# EAGLE design ACC (EAGLE 9.6.2)
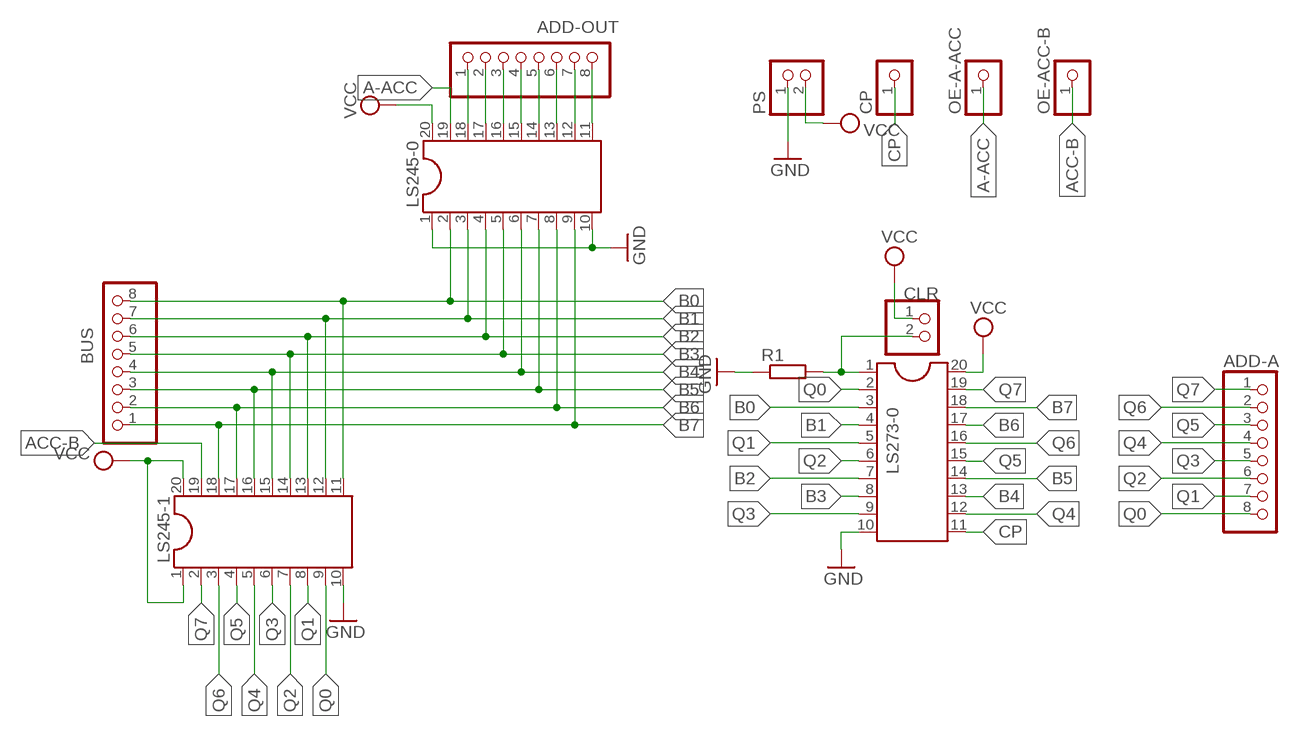
[diagram p0: schematic, sheet 1]

## Parts
ADD-A  PINHD-1X8  [1X08]
ADD-OUT  PINHD-1X8  [1X08]
BUS  PINHD-1X8  [1X08]
CLR  PINHD-1X2  [1X02]
CP  PINHD-1X1  [1X01]
LS245-0  DIL20S  [SOCKET-20]
LS245-1  DIL20S  [SOCKET-20]
LS273-0  DIL20S  [SOCKET-20]
OE-A-ACC  PINHD-1X1  [1X01]
OE-ACC-B  PINHD-1X1  [1X01]
PS  PINHD-1X2  [1X02]
R1  R-EU_0204/7  [0204/7]

## Nets
A-ACC: LS245-0.19 OE-A-ACC.1
ACC-B: LS245-1.19 OE-ACC-B.1
B0: BUS.8 LS245-0.2 LS245-1.11 LS273-0.3
B1: BUS.7 LS245-0.3 LS245-1.12 LS273-0.4
B2: BUS.6 LS245-0.4 LS245-1.13 LS273-0.7
B3: BUS.5 LS245-0.5 LS245-1.14 LS273-0.8
B4: BUS.4 LS245-0.6 LS245-1.15 LS273-0.13
B5: BUS.3 LS245-0.7 LS245-1.16 LS273-0.14
B6: BUS.2 LS245-0.8 LS245-1.17 LS273-0.17
B7: BUS.1 LS245-0.9 LS245-1.18 LS273-0.18
CLR: CLR.2 LS273-0.1 R1.2
CP: CP.1 LS273-0.11
GND: LS245-0.1 LS245-0.10 LS245-1.10 LS273-0.10 PS.1 R1.1
O0: ADD-OUT.1 LS245-0.18
O1: ADD-OUT.2 LS245-0.17
O2: ADD-OUT.3 LS245-0.16
O3: ADD-OUT.4 LS245-0.15
O4: ADD-OUT.5 LS245-0.14
O5: ADD-OUT.6 LS245-0.13
O6: ADD-OUT.7 LS245-0.12
O7: ADD-OUT.8 LS245-0.11
Q0: ADD-A.8 LS245-1.9 LS273-0.2
Q1: ADD-A.7 LS245-1.8 LS273-0.5
Q2: ADD-A.6 LS245-1.7 LS273-0.6
Q3: ADD-A.5 LS245-1.6 LS273-0.9
Q4: ADD-A.4 LS245-1.5 LS273-0.12
Q5: ADD-A.3 LS245-1.4 LS273-0.15
Q6: ADD-A.2 LS245-1.3 LS273-0.16
Q7: ADD-A.1 LS245-1.2 LS273-0.19
VCC: CLR.1 LS245-0.20 LS245-1.1 LS245-1.20 LS273-0.20 PS.2

## Library data of the parts
ADD-A ADD-OUT BUS = pinhead:PINHD-1X8: PIN HEADER
CLR PS = pinhead:PINHD-1X2: PIN HEADER
CP OE-A-ACC OE-ACC-B = pinhead:PINHD-1X1: PIN HEADER
LS245-0 LS245-1 LS273-0 = ic-package:DIL20: Dual In Line / Socket
R1 = rcl:R-EU_: RESISTOR, European symbol; SPICEPREFIX: R

## Board
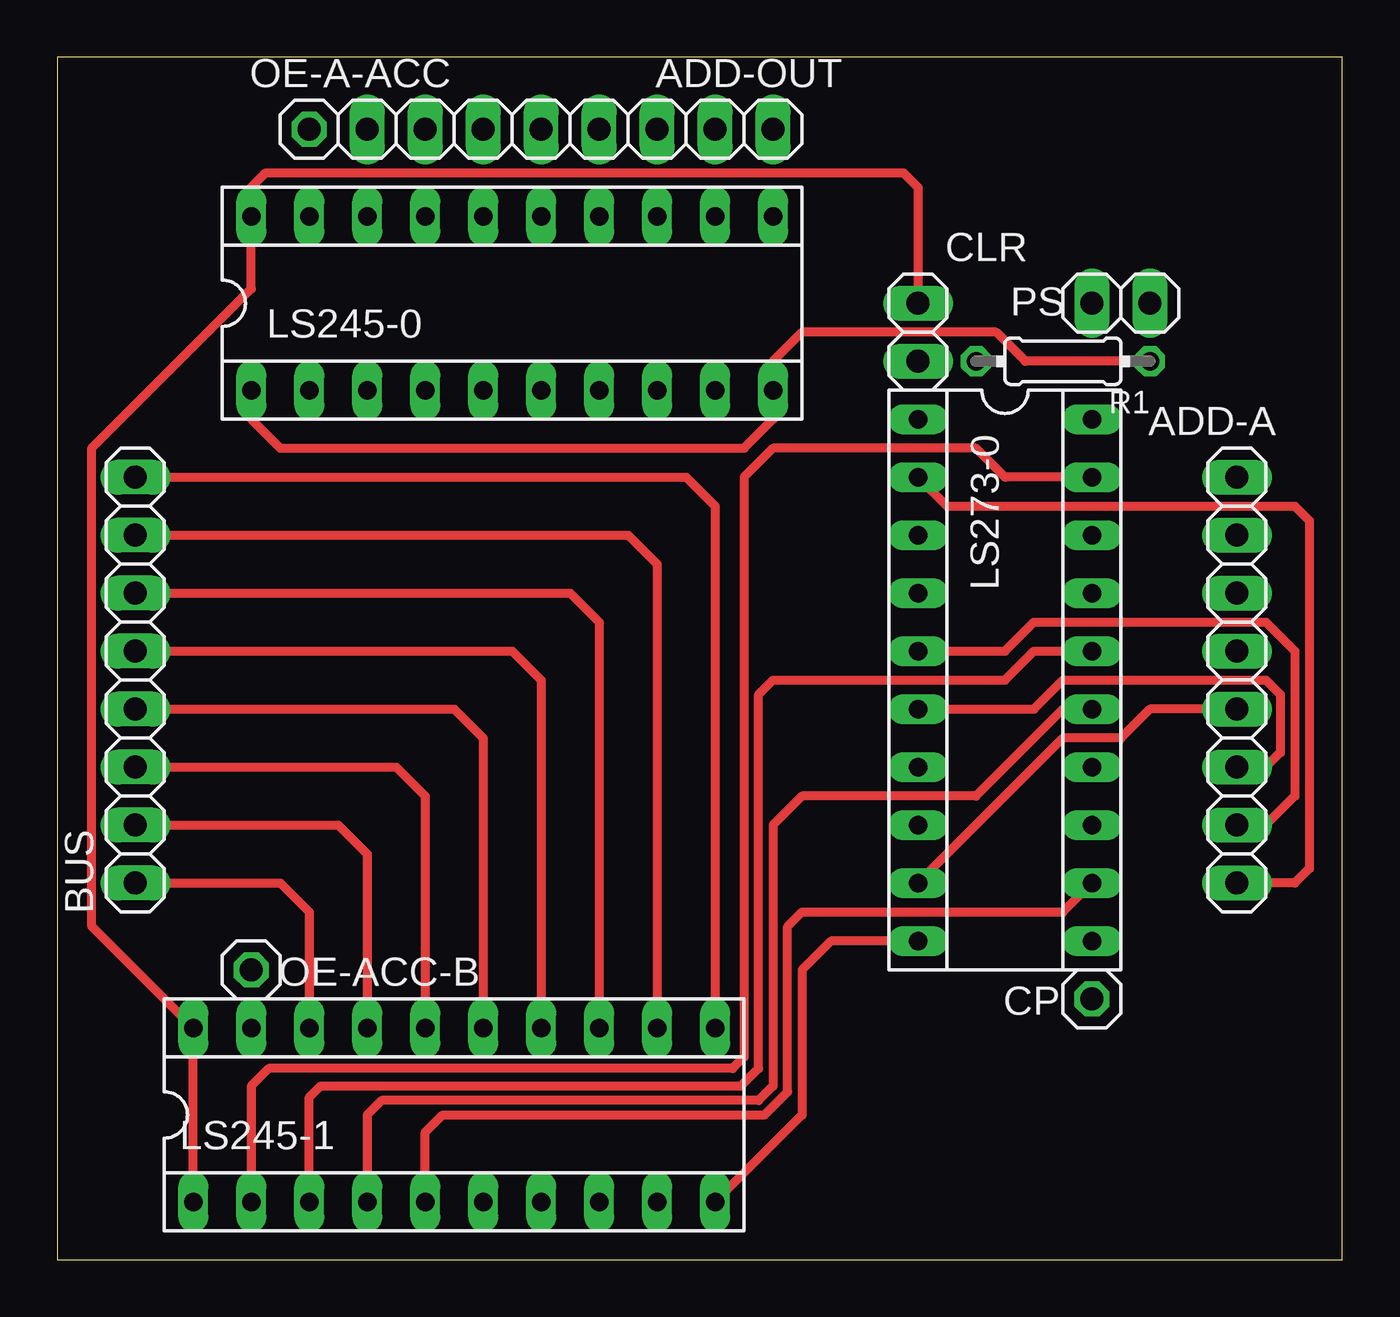
[diagram p1: board, top side]
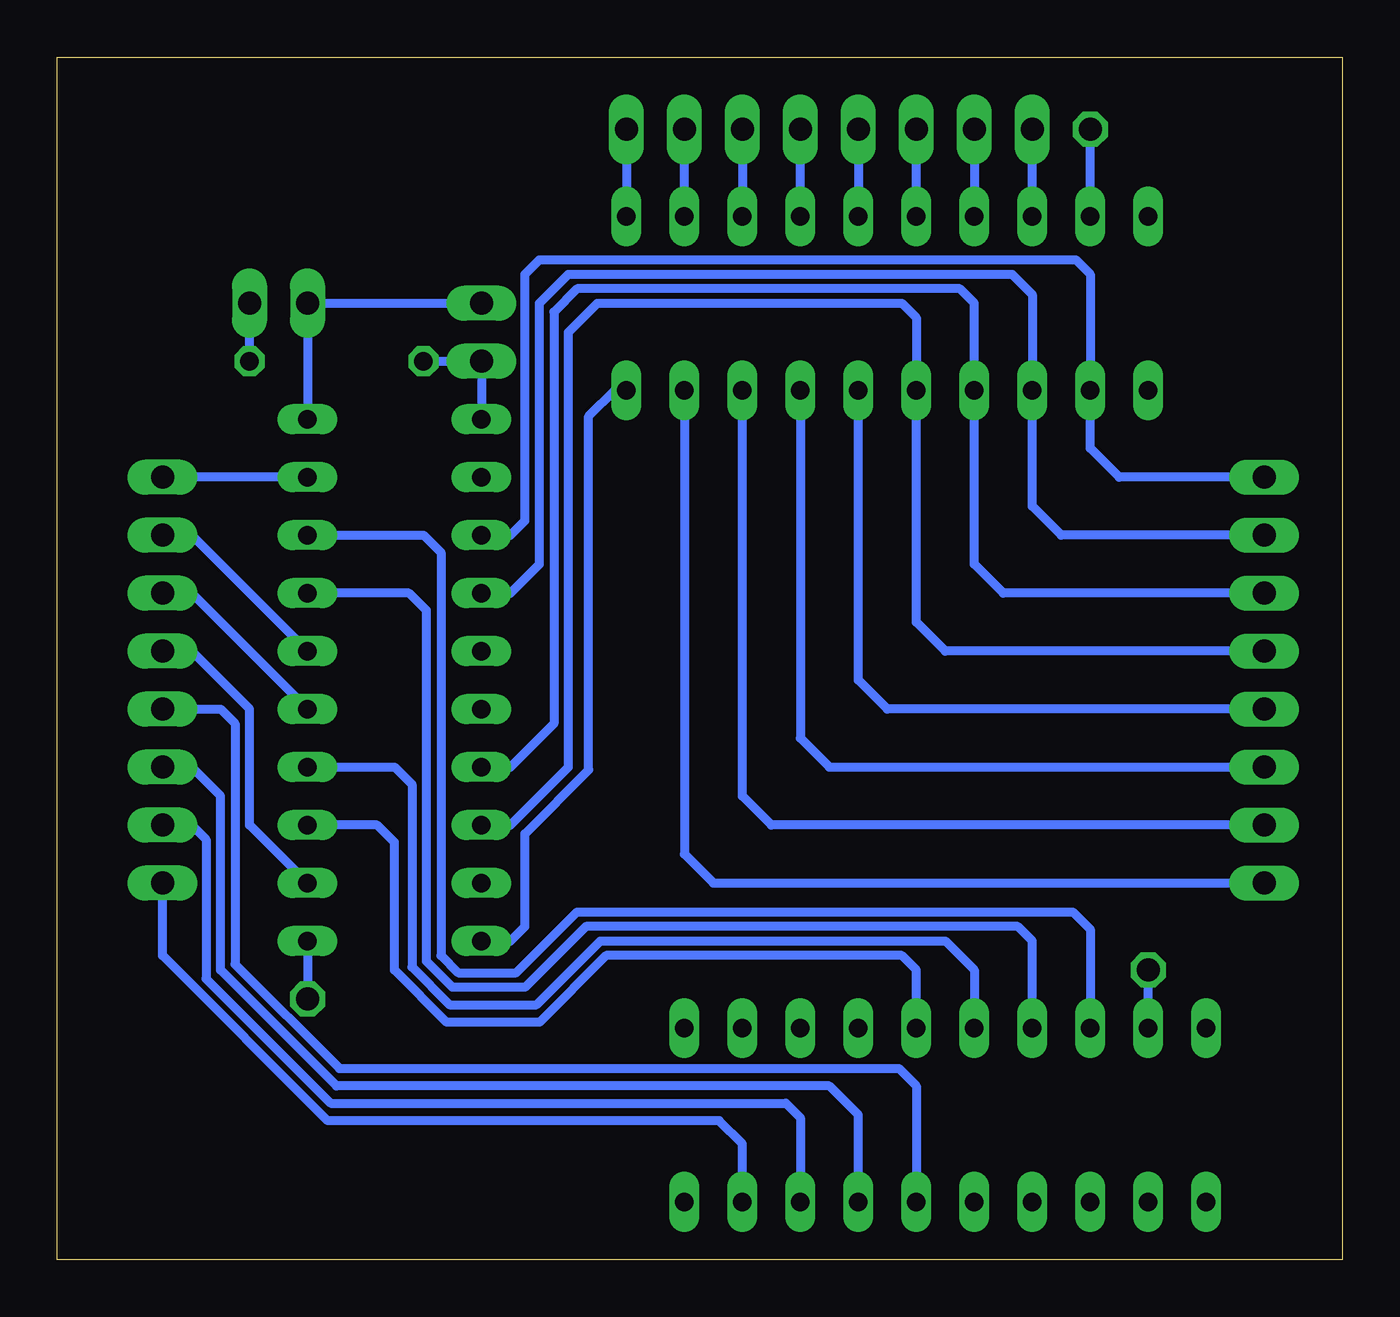
[diagram p2: board, bottom side, seen from below]

Size 56.31 x 52.7 mm. Coordinates in mm from the lower left corner, seen from the top.
Outline: 0,0 56.31,0 56.31,52.7 0,52.7 0,0
Copper layers (1*16): Top 0.035mm / dielectric 1.5mm / Bottom 0.035mm
Design rules "default": minimum track width 6mil, minimum drill 0.35mm, track to track 6mil, track to pad 6mil, pad to pad 6mil, via to via 6mil, smd to smd 6mil, copper to edge 40mil, drill to drill 6mil, minimum pad ring 10mil, minimum via ring 8mil, stop-mask expansion 4mil, vias tented up to drill 0mil, thermal gap 10mil

### Footprints (pad centres in the part's own frame; a part is rotated, then mirrored left to right if it is on the bottom)
1X08 = drill 1.016 long: 1 -8.89,0; 2 -6.35,0; 3 -3.81,0; 4 -1.27,0; 5 1.27,0; 6 3.81,0; 7 6.35,0; 8 8.89,0
1X02 = drill 1.016 long: 1 -1.27,0; 2 1.27,0
1X01 = drill 1.016 octagon: 1 0,0
SOCKET-20 = drill 0.813 long: 1 -11.43,-3.81; 2 -8.89,-3.81; 3 -6.35,-3.81; 4 -3.81,-3.81; 5 -1.27,-3.81; 6 1.27,-3.81; 7 3.81,-3.81; 8 6.35,-3.81; 9 8.89,-3.81; 10 11.43,-3.81; 11 11.43,3.81; 12 8.89,3.81; 13 6.35,3.81; 14 3.81,3.81; 15 1.27,3.81; 16 -1.27,3.81; 17 -3.81,3.81; 18 -6.35,3.81; 19 -8.89,3.81; 20 -11.43,3.81
0204/7 = drill 0.813 octagon: 1 -3.81,0; 2 3.81,0

### Placement (x,y rotation side)
ADD-A  51.69,25.4 270 top
ADD-OUT  22.48,49.53 0 top
BUS  3.43,25.4 90 top
CLR  37.72,40.64 270 top
CP  45.34,11.43 0 top
LS245-0  19.94,41.91 0 top
LS245-1  17.4,6.35 0 top
LS273-0  41.53,25.4 270 top
OE-A-ACC  11.05,49.53 0 top
OE-ACC-B  8.51,12.7 0 top
PS  46.61,41.91 180 top
R1  44.07,39.37 180 top

### Tracks (layer width: path | path; a pad name or v marks a point on that pad's centre or on a via)
A-ACC
  Bottom 0.4: LS245-0.19 OE-A-ACC.1
ACC-B
  Bottom 0.4: LS245-1.19 OE-ACC-B.1
B0
  Top 0.4: LS245-1.11 28.83,33.02 27.56,34.29 BUS.8
  Bottom 0.4: BUS.8 9.78,34.29 11.05,35.56 LS245-0.2 11.05,43.18 11.68,43.81 35.18,43.81 35.81,43.18 35.81,32.38 36.45,31.75 LS273-0.3
B1
  Top 0.4: LS245-1.12 26.29,30.48 25.02,31.75 BUS.7
  Bottom 0.4: BUS.7 12.32,31.75 13.59,33.02 LS245-0.3 13.59,42.29 14.48,43.18 33.91,43.18 35.18,41.91 35.18,30.48 36.45,29.21 LS273-0.4
B2
  Top 0.4: LS245-1.13 23.75,27.94 22.48,29.21 BUS.6
  Bottom 0.4: BUS.6 14.86,29.21 16.13,30.48 LS245-0.4 16.13,41.91 16.76,42.55 33.53,42.55 34.54,41.53 34.54,23.5 36.45,21.59 LS273-0.7
B3
  Top 0.4: BUS.5 19.94,26.67 21.21,25.4 LS245-1.14
  Bottom 0.4: BUS.5 17.4,26.67 18.67,27.94 LS245-0.5 18.67,41.27 19.3,41.91 32.64,41.91 33.91,40.64 33.91,21.59 36.45,19.05 LS273-0.8
B4
  Top 0.4: BUS.4 17.4,24.13 18.67,22.86 LS245-1.15
  Bottom 0.4: BUS.4 19.94,24.13 21.21,25.4 LS245-0.6 | LS273-0.13 42.29,19.05 41.53,18.29 41.53,12.7 39.24,10.41 35.18,10.41 32.26,13.34 19.3,13.34 18.67,12.7 LS245-1.15
B5
  Top 0.4: BUS.3 14.86,21.59 16.13,20.32 LS245-1.16
  Bottom 0.4: LS245-0.7 23.75,22.86 22.48,21.59 BUS.3 | LS273-0.14 41.53,21.59 40.77,20.83 40.77,12.83 39.12,11.18 35.31,11.18 32.51,13.97 17.4,13.97 16.13,12.7 LS245-1.16
B6
  Top 0.4: BUS.2 12.32,19.05 13.59,17.78 LS245-1.17
  Bottom 0.4: LS245-0.8 26.29,20.32 25.02,19.05 BUS.2 | LS245-1.17 13.59,13.97 14.22,14.61 33.15,14.61 35.81,11.94 38.99,11.94 40.13,13.08 40.13,28.45 40.89,29.21 LS273-0.17
B7
  Top 0.4: BUS.1 9.78,16.51 11.05,15.24 LS245-1.18
  Bottom 0.4: LS245-0.9 28.83,17.78 27.56,16.51 BUS.1 | LS245-1.18 11.05,14.48 11.81,15.24 33.53,15.24 36.2,12.57 38.73,12.57 39.5,13.34 39.5,30.99 40.26,31.75 LS273-0.18
CLR
  Bottom 0.4: LS273-0.1 CLR.2 R1.2
CP
  Bottom 0.4: LS273-0.11 CP.1
GND
  Top 0.4: LS245-0.1 8.51,36.83 9.78,35.56 30.1,35.56 31.37,36.83 LS245-0.10 31.37,39.37 32.64,40.64 41.15,40.64 42.42,39.37 R1.1 | LS273-0.10 33.91,13.97 32.64,12.7 32.64,6.35 LS245-1.10
  Bottom 0.4: R1.1 PS.1 | LS273-0.10 36.45,13.97 35.81,14.61 35.81,18.67 33.02,21.46 33.02,36.96 31.88,38.1 LS245-0.10
O0
  Bottom 0.4: LS245-0.18 ADD-OUT.1
O1
  Bottom 0.4: ADD-OUT.2 LS245-0.17
O2
  Bottom 0.4: LS245-0.16 ADD-OUT.3
O3
  Bottom 0.4: ADD-OUT.4 LS245-0.15
O4
  Bottom 0.4: LS245-0.14 ADD-OUT.5
O5
  Bottom 0.4: ADD-OUT.6 LS245-0.13
O6
  Bottom 0.4: LS245-0.12 ADD-OUT.7
O7
  Bottom 0.4: ADD-OUT.8 LS245-0.11
Q0
  Top 0.4: LS273-0.2 38.99,33.02 54.23,33.02 54.86,32.38 54.86,17.14 54.23,16.51 ADD-A.8
  Bottom 0.4: LS245-1.9 26.29,5.08 27.3,6.1 44.45,6.1 51.69,13.34 ADD-A.8
Q1
  Top 0.4: ADD-A.7 52.96,19.05 54.23,20.32 54.23,26.67 52.96,27.94 42.8,27.94 41.53,26.67 LS273-0.5
  Bottom 0.4: ADD-A.7 50.42,19.05 49.78,18.41 49.78,12.32 44.32,6.86 24.38,6.86 23.75,6.22 LS245-1.8
Q2
  Top 0.4: ADD-A.6 52.96,21.59 53.59,22.23 53.59,24.77 52.96,25.4 44.07,25.4 42.8,24.13 LS273-0.6
  Bottom 0.4: LS245-1.7 21.21,6.35 22.48,7.62 44.07,7.62 49.15,12.7 49.15,20.32 50.42,21.59 ADD-A.6
Q3
  Top 0.4: ADD-A.5 47.88,24.13 46.61,22.86 44.07,22.86 LS273-0.9
  Bottom 0.4: ADD-A.5 49.15,24.13 48.51,23.5 48.51,12.95 43.94,8.38 19.43,8.38 18.67,7.62 LS245-1.6
Q4
  Top 0.4: LS273-0.12 44.07,15.24 32.64,15.24 32,14.61 32,7.37 30.99,6.35 16.89,6.35 16.13,5.59 LS245-1.5
  Bottom 0.4: LS273-0.12 47.88,19.05 47.88,24.13 50.42,26.67 ADD-A.4
Q5
  Top 0.4: LS273-0.15 44.07,24.13 40.26,20.32 32.64,20.32 31.37,19.05 31.37,7.62 30.73,6.99 14.22,6.99 13.59,6.35 LS245-1.4
  Bottom 0.4: LS273-0.15 50.42,29.21 ADD-A.3
Q6
  Top 0.4: LS273-0.16 42.8,26.67 41.53,25.4 31.37,25.4 30.73,24.77 30.73,8.38 29.97,7.62 11.56,7.62 11.05,7.11 LS245-1.3
  Bottom 0.4: LS273-0.16 50.42,31.75 ADD-A.2
Q7
  Top 0.4: LS245-1.2 8.51,7.62 9.27,8.38 29.59,8.38 30.1,8.89 30.1,34.29 31.37,35.56 40.26,35.56 41.53,34.29 LS273-0.19
  Bottom 0.4: LS273-0.19 ADD-A.1
VCC
  Top 0.4: LS245-1.1 LS245-1.20 1.52,14.61 1.52,35.56 8.51,42.55 LS245-0.20 8.51,46.99 9.14,47.62 37.08,47.62 37.72,46.99 CLR.1
  Bottom 0.4: LS273-0.20 PS.2 CLR.1